# EAGLE design 2 Relay module (EAGLE 7.2.0)
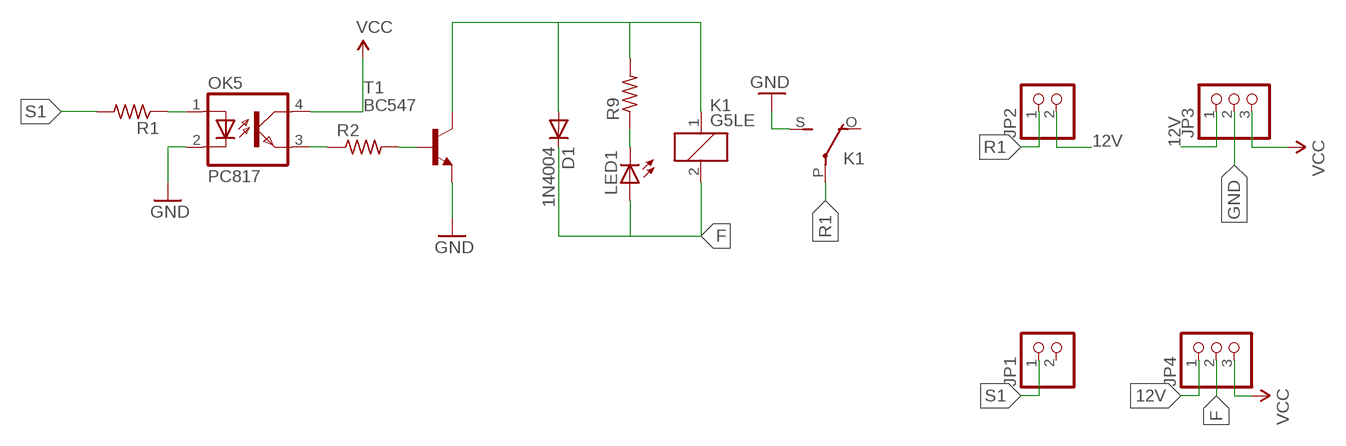
[diagram p0: schematic, sheet 1]

## Parts
D1  1N4004  [DO41-10]
JP1  PINHD-1X2  [1X02]
JP2  PINHD-1X2  [1X02]
JP3  PINHD-1X3  [1X03]
JP4  PINHD-1X3  [1X03]
K1  G5LE  [G5LE]
LED1  LED3MM  [LED3MM]
OK5  PC817  [DIL04]
R1  R-US_0204/7  [0204/7]
R2  R-US_0204/7  [0204/7]
R9  R-US_0204/7  [0204/7]
T1  BC547  [TO92]

## Nets
12V: JP2.2 JP3.1 JP4.1
F: D1.C JP4.2 K1.2 LED1.A
GND: JP3.2 K1.S(2:S) OK5.2(C) T1.1(E)
N$4: LED1.K(C) R9.1
N$5: OK5.3(EMIT) R2.1
N$9: OK5.1(A) R1.1
N$11: R2.2 T1.2(B)
N$36: D1.A K1.1 R9.2 T1.3(C)
R1: JP2.1 K1.P(2:P)
S1: JP1.1 R1.2
VCC: JP3.3 JP4.3 OK5.4(COL)
Unconnected: JP1.2 K1.O(2:O)

## Library data of the parts
D1 = diode:1N4004: DIODE general purpose rectifier, 1 A
JP1 JP2 = pinhead:PINHD-1X2: PIN HEADER
JP3 JP4 = pinhead:PINHD-1X3: PIN HEADER
K1 = relay:G5LE: RELAY 1 x switch, 10 A/120 V AC, 8 A/30 V DC, Omron; OC_FARNELL: unknown; OC_NEWARK: unknown
LED1 = led:LED: LED OSRAM: - CHIPLED LG R971, LG N971, LY N971, LG Q971, LY Q971, LO R971, LY R971 LH N974, LH R974 LS Q976, LO Q976, LY Q976 LO Q996 - Hyper CHIPLED LW Q18S LB Q993, LB Q99A, LB R99A - SideLED LS A670, LO A670, LY A670, LG A670, LP A670 LB A673, LV A673, LT A673, LW A673 LH A674 LY A675 LS A676, LA A676, LO A676, LY A676, LW A676 LS A679, LY A679, LG A679 - Hyper Micro SIDELED® LS Y876, LA Y876, LO Y876, LY Y876 LT Y87S - SmartLED LW L88C, LW L88S LB L89C, LB L89S, LG L890 LS L89K, LO L89K, LY L89K LS L896, LA L896, LO L896, LY L896 - TOPLED LS T670, LO T670, LY T670, LG T670, LP T670 LSG T670, LSP T670, LSY T670, LOP T670, LYG T670 LG T671, LOG T671, LSG T671 LB T673, LV T673, LT T673, LW T673 LH T674 LS T676, LA T676, LO T676, LY T676, LB T676, LH T676, LSB T676, LW T676 LB T67C, LV T67C, LT T67C, LS T67K, LO T67K, LY T67K, LW E67C LS E67B, LA E67B, LO E67B, LY E67B, LB E67C, LV E67C, LT E67C LW T67C LS T679, LY T679, LG T679 LS T770, LO T770, LY T770, LG T770, LP T770 LB T773, LV T773, LT T773, LW T773 LH T774 LS E675, LA E675, LY E675, LS T675 LS T776, LA T776, LO T776, LY T776, LB T776 LHGB T686 LT T68C, LB T68C - Hyper Mini TOPLED® LB M676 - Mini TOPLED Santana® LG M470 LS M47K, LO M47K, LY M47K Source: http://www.osram.convergy.de LUXEON: - LUMILED® LXK2-PW12-R00, LXK2-PW12-S00, LXK2-PW14-U00, LXK2-PW14-V00 LXK2-PM12-R00, LXK2-PM12-S00, LXK2-PM14-U00 LXK2-PE12-Q00, LXK2-PE12-R00, LXK2-PE12-S00, LXK2-PE14-T00, LXK2-PE14-U00 LXK2-PB12-K00, LXK2-PB12-L00, LXK2-PB12-M00, LXK2-PB14-N00, LXK2-PB14-P00, LXK2-PB14-Q00 LXK2-PR12-L00, LXK2-PR12-M00, LXK2-PR14-Q00, LXK2-PR14-R00 LXK2-PD12-Q00, LXK2-PD12-R00, LXK2-PD12-S00 LXK2-PH12-R00, LXK2-PH12-S00 LXK2-PL12-P00, LXK2-PL12-Q00, LXK2-PL12-R00 Source: www.luxeon.com KINGBRIGHT: KA-3528ASYC Source: www.kingbright.com
OK5 = optocoupler:PC817: SHARP OPTO COUPLER; MPN: PC817X4J000F; OC_FARNELL: 9707727; OC_NEWARK: 97K7059
R1 R2 R9 = rcl:R-US_: RESISTOR, American symbol
T1 = transistor:BC547: NPN TRANSISTOR

## Board
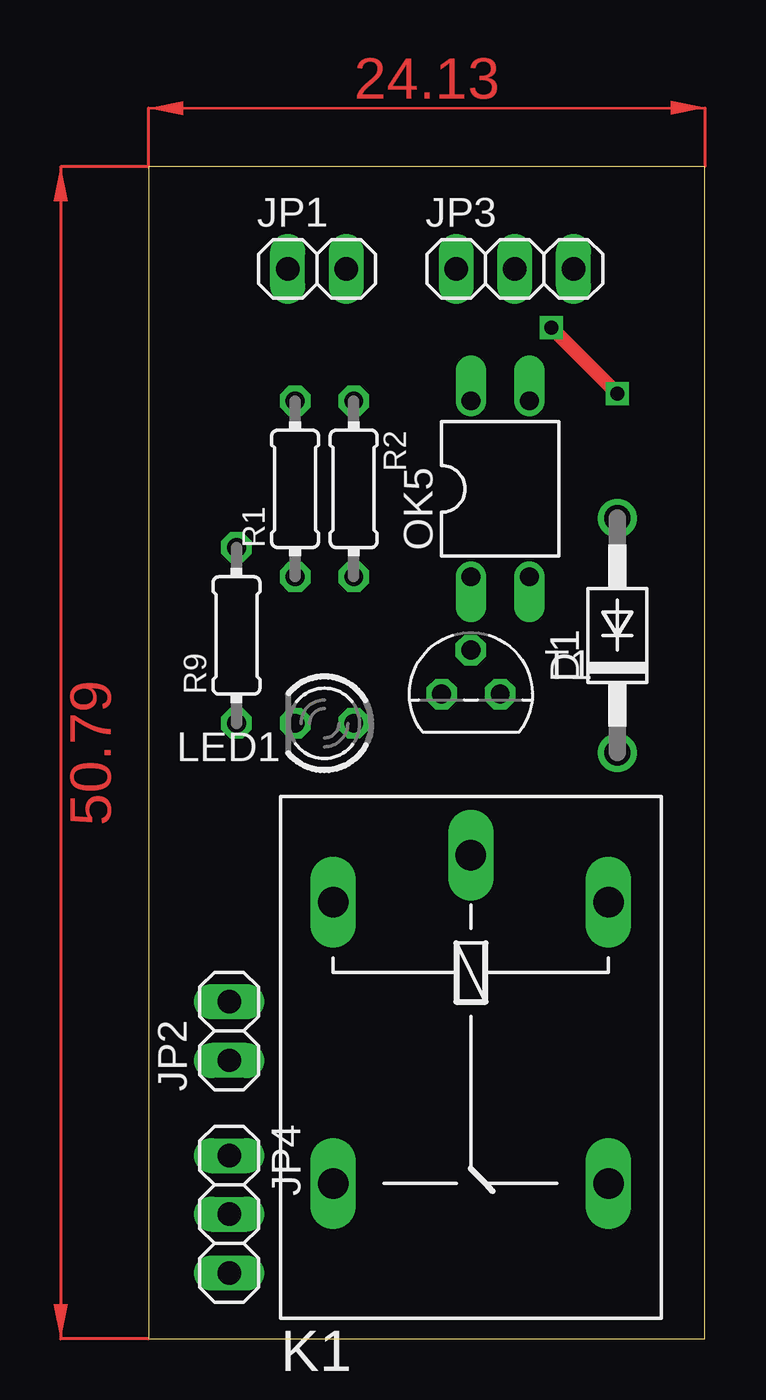
[diagram p1: board, top side]
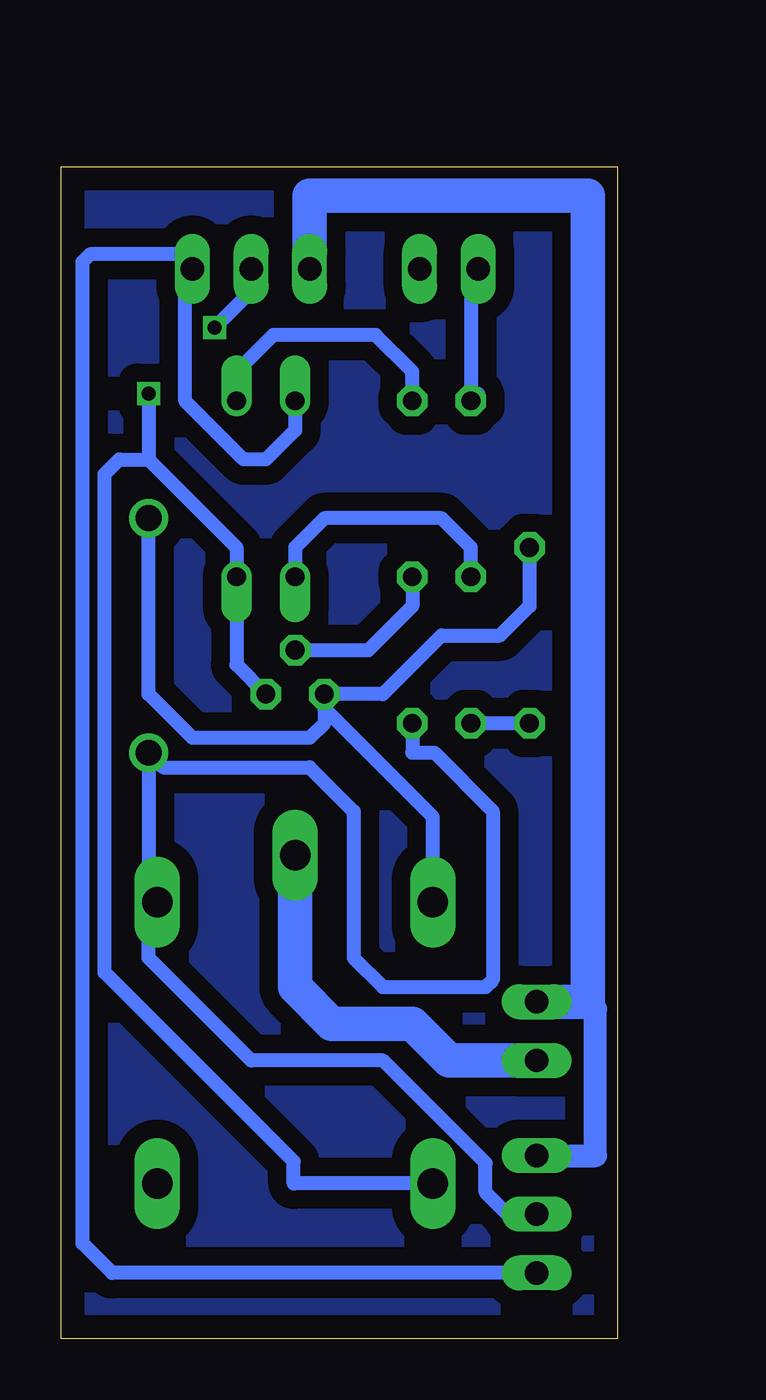
[diagram p2: board, bottom side, seen from below]

Size 24.11 x 50.79 mm. Coordinates in mm from the lower left corner, seen from the top.
Outline: 0,0 24.11,0 24.11,50.79 0,50.79 0,0
Copper layers (1*16): Top 0.035mm / dielectric 1.5mm / Bottom 0.035mm
Design rules "default *": minimum track width 0.6mm, minimum drill 0.8mm, track to track 0.8mm, track to pad 0.8mm, pad to pad 8mil, via to via 8mil, smd to smd 8mil, copper to edge 40mil, drill to drill 8mil, minimum pad ring 10mil, minimum via ring 8mil, stop-mask expansion 4mil, vias tented up to drill 0mil, thermal gap 10mil

### Footprints (pad centres in the part's own frame; a part is rotated, then mirrored left to right if it is on the bottom)
DO41-10 = drill 1.118: A 5.08,0; C -5.08,0
1X02 = drill 1.016 long: 1 -1.27,0; 2 1.27,0
1X03 = drill 1.016 long: 1 -2.54,0; 2 0,0; 3 2.54,0
G5LE = drill 1.321 long: 1 -7.493,-5.969; 2 -7.493,5.969; O 4.699,5.969; P -9.525,0; S 4.699,-5.969
LED3MM = drill 0.813 octagon: A -1.27,0; K 1.27,0
DIL04 = drill 0.813 offset: 1 -1.27,-3.81; 2 1.27,-3.81; 3 1.27,3.81; 4 -1.27,3.81
0204/7 = drill 0.813 octagon: 1 -3.81,0; 2 3.81,0
TO92 = drill 0.813 octagon: 1 1.27,0; 2 0,1.905; 3 -1.27,0

### Placement (x,y rotation side)
D1  20.32,30.48 90 top
JP1  7.3,46.36 0 top
JP2  3.49,13.33 90 top
JP3  15.88,46.36 0 top
JP4  3.49,5.4 270 top
K1  13.97,11.43 270 top
LED1  7.62,26.67 180 top
OK5  15.24,36.83 0 top
R1  6.35,36.83 90 top
R2  8.89,36.83 270 top
R9  3.81,30.48 90 top
T1  13.97,27.94 0 top

### Tracks (layer width: path | path; a pad name or v marks a point on that pad's centre or on a via)
12V
  Bottom 0.6: 13.02,46.04 JP3.1 13.33,45.72
  Bottom 1: JP4.1 0.95,7.94 0.95,14.29 1.27,14.61
  Bottom 1.5: JP2.2 1.27,14.61 1.27,49.53 13.33,49.53 JP3.1
F
  Bottom 0.6: LED1.A 8.89,25.4 7.94,25.4 5.4,22.86 5.4,15.56 5.71,15.24 10.16,15.24 11.43,16.51 11.43,22.86 13.33,24.76 19.69,24.76 D1.C 20.32,19.3 K1.2 20.32,18.54 20.32,16.51 15.88,12.06 10.16,12.06 5.71,7.62 5.71,6.35 4.76,5.4 JP4.2
GND  (via drill 0.6)
  Top 0.6: v17.46,43.82 v20.32,40.96
  Bottom 0.6: T1.1 16.51,29.21 OK5.2 16.51,34.29 20.32,38.1 | K1.S 14.03,6.73 14.03,7.68 22.23,15.88 22.23,37.47 21.59,38.1 20.32,38.1 | JP3.2 15.88,45.4 v17.46,43.82 | v20.32,40.96 20.32,38.1
N$1
  pour Bottom: 0,50.8 24.13,50.8 24.13,0 0,0
N$4
  Bottom 0.6: R9.1 LED1.K
N$5
  Bottom 0.6: R2.1 8.89,41.91 10.48,43.5 14.92,43.5 16.51,41.91 OK5.3
N$9
  Bottom 0.6: R1.1 6.35,34.29 7.62,35.56 12.7,35.56 13.97,34.29 OK5.1
N$11
  Bottom 0.6: R2.2 8.89,31.75 10.79,29.85 T1.2
N$36
  Bottom 0.6: D1.A 20.32,27.94 18.41,26.04 13.33,26.04 12.7,26.67 12.7,27.3 | R9.2 3.81,31.75 5.08,30.48 7.62,30.48 10.16,27.94 T1.3 12.7,27.3 | K1.1 8,22.61 12.7,27.3
R1
  Bottom 1.5: K1.P 13.97,15.24 12.38,13.65 8.89,13.65 7.3,12.06 JP2.1
S1
  Bottom 0.6: 6.03,40.96 R1.2 6.35,46.36 JP1.1
VCC
  Bottom 0.6: OK5.4 13.97,39.37 15.24,38.1 16.19,38.1 18.73,40.64 18.73,46.04 JP3.3 19.05,46.99 22.86,46.99 23.18,46.67 23.18,4.13 21.91,2.86 JP4.3
(copper drawn outside any net)
  shapes: Top area x2